# Altium schematic sheet MCU,SD,FLASH.SchDoc
size A3; SheetNumber: 2; SheetTotal: 5
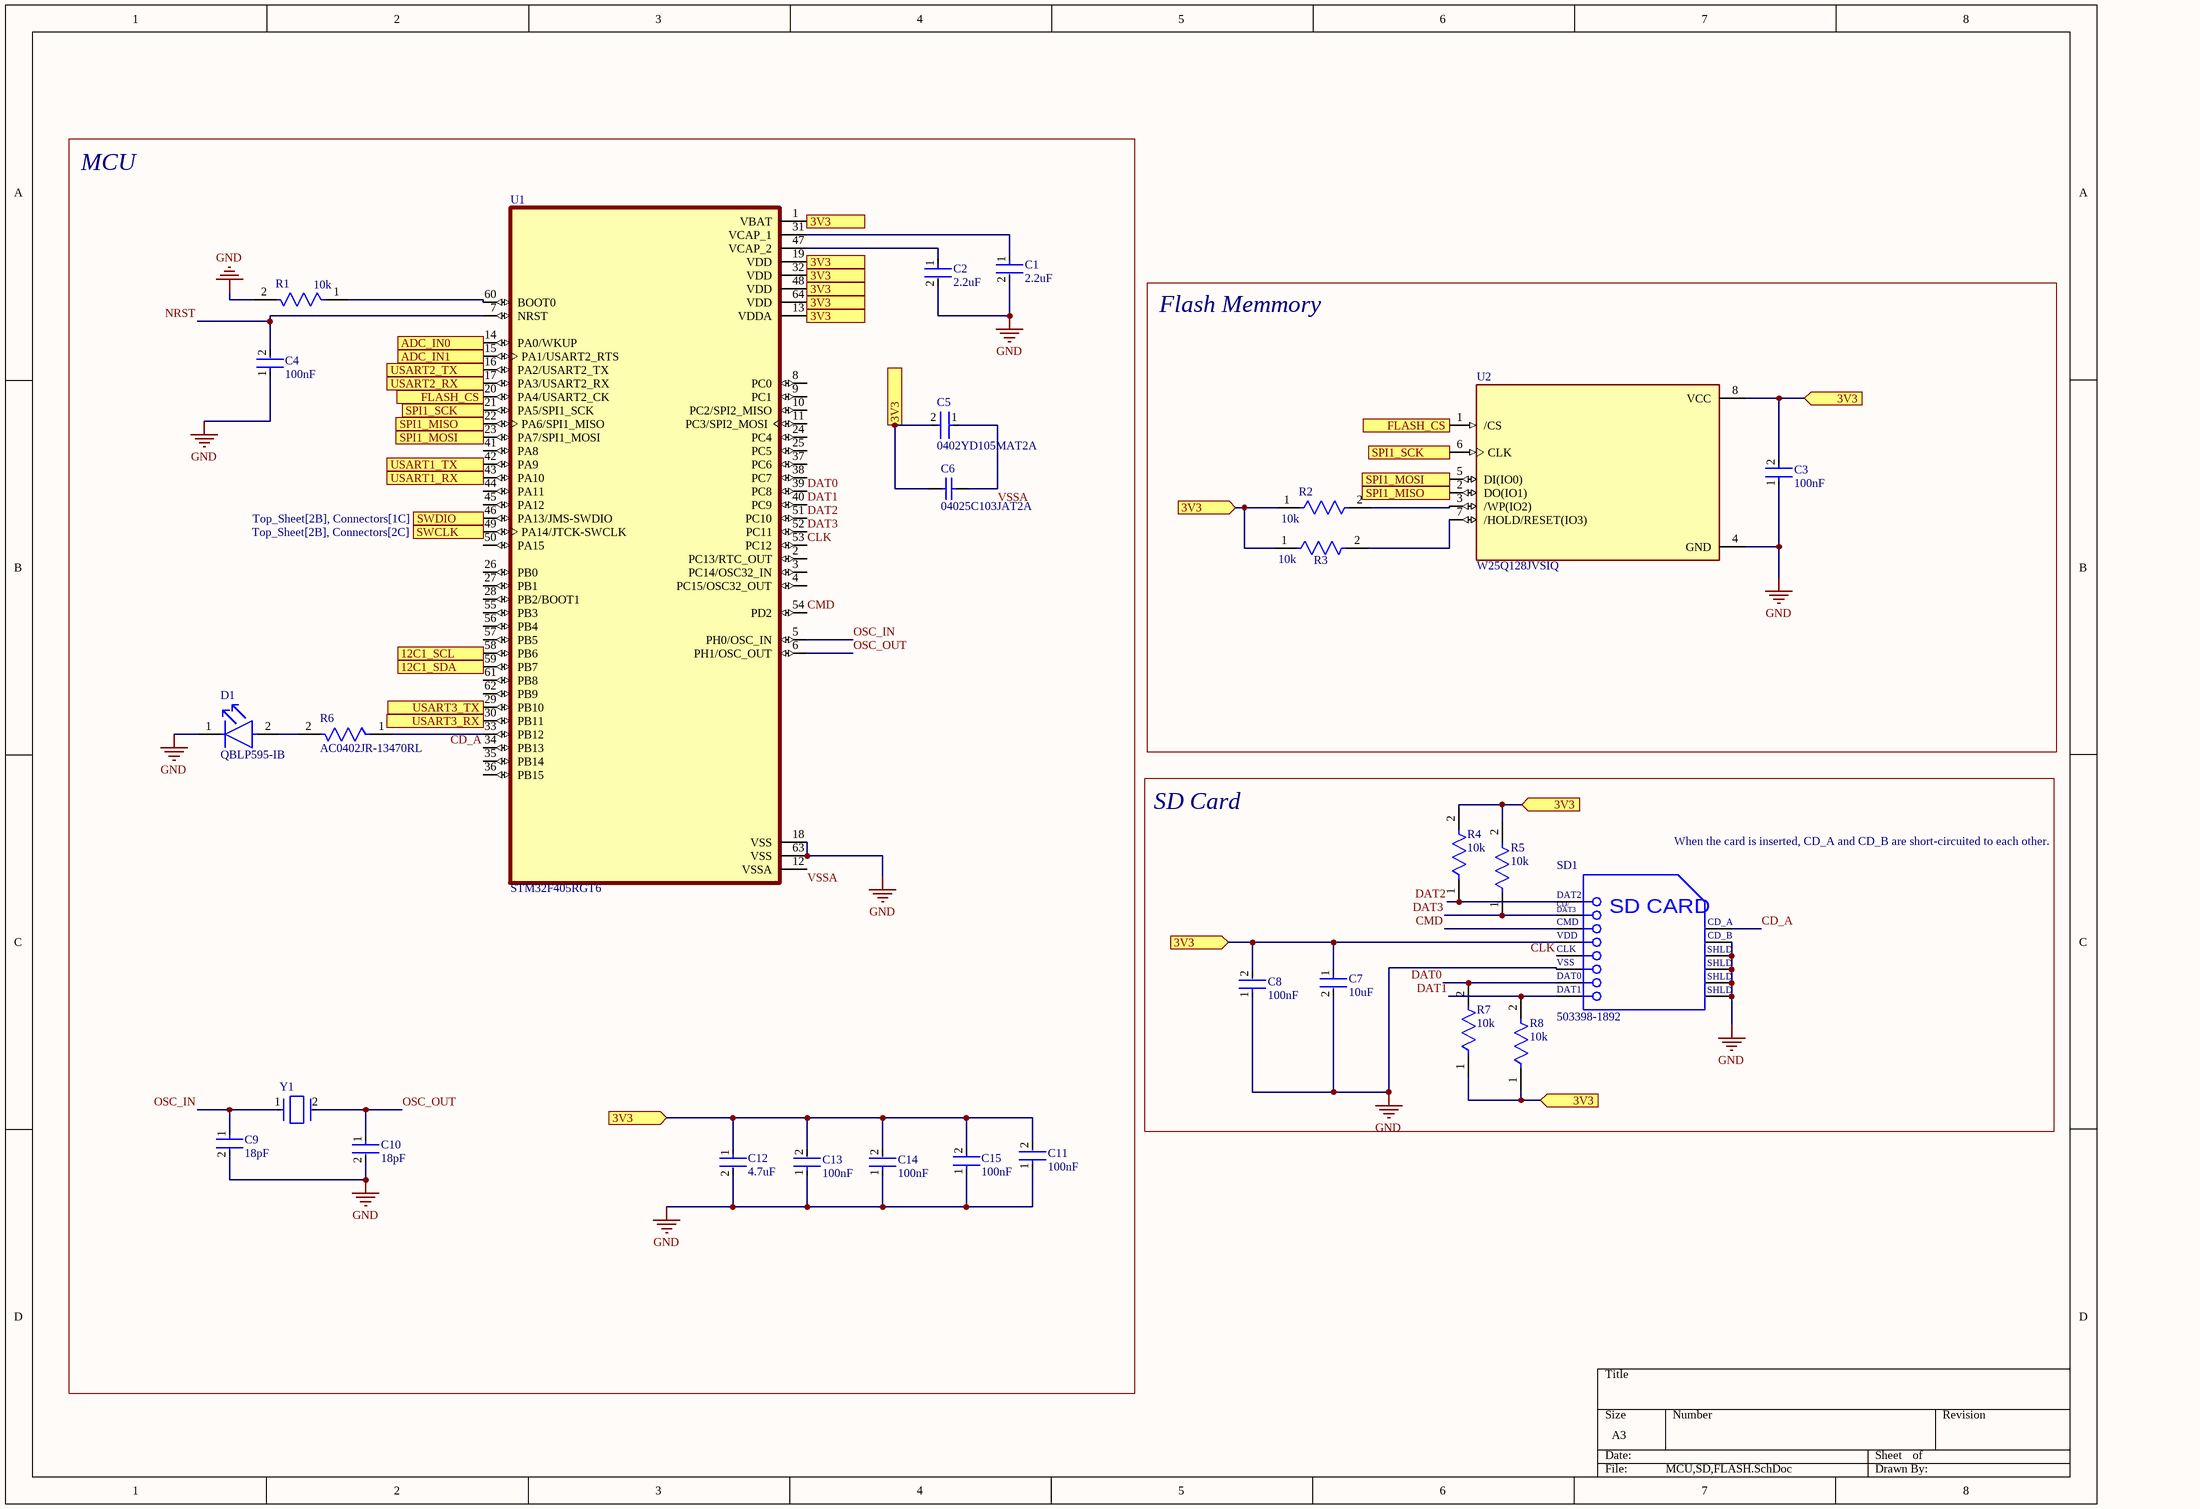
[diagram p0: MCU,SD,FLASH.SchDoc]

## Parts
C1  2.2uF  [FP-CC0402-MFG]
C2  2.2uF  [FP-CC0402-MFG]
C3  100nF  [FP-C0402-BB-MFG]
C4  100nF  [FP-C0402-BB-MFG]
C5  0402YD105MAT2A  [FP-0402-L_1_0_1-W_0_5_0_1-MFG]
C6  04025C103JAT2A  [CAPC1005X56X25LL10T15]
C7  10uF  [FP-C0402C106M9PACTU-MFG]
C8  100nF  [FP-C0402-BB-MFG]
C9  18pF  [FP-GJM033-0_03P-MFG]
C10  18pF  [FP-GJM033-0_03P-MFG]
C11  100nF  [FP-C0402-BB-MFG]
C12  4.7uF  [FP-CC0402-MFG]
C13  100nF  [FP-C0402-BB-MFG]
C14  100nF  [FP-C0402-BB-MFG]
C15  100nF  [FP-C0402-BB-MFG]
D1  QBLP595-IB  [FP-QBLP595-IB-MFG]
R1  10k  [FP-AF0402-IPC_B]
R2  10k  [FP-AF0402-IPC_B]
R3  10k  [FP-AF0402-IPC_B]
R4  10k  [FP-AF0402-IPC_B]
R5  10k  [FP-AF0402-IPC_B]
R6  AC0402JR-13470RL  [FP-AC0402-MFG]
R7  10k  [FP-AF0402-IPC_B]
R8  10k  [FP-AF0402-IPC_B]
SD1  503398-1892  [MOLX-503398-1892_V]
U1  STM32F405RGT6  [QFP50P1200X1200X160-64N]
U2  W25Q128JVSIQ  [SOIC127P790X216-8N]
Y1  ABM3-8.000MHZ-B4Y-T  [FP-ABM3-MFG]  (value not drawn)

## Blocks framed on the sheet
MCU: C1 C2 C4-C6 C9-C15 D1 R1 R6 U1 Y1
Flash Memmory: C3 R2 R3 U2
SD Card: C7 C8 R4 R5 R7 R8 SD1

## Ports
3V3 (in, see Top_Sheet[1B], Connectors[1C], Connectors[2A], Connectors[3A], Connectors[3C], Power[3C], RF_Sensors[2B], RF_Sensors[3A]), 12C1_SCL (out, see Top_Sheet[2B], Connectors[2B]), 12C1_SDA (out, see Top_Sheet[2A], Connectors[2B]), ADC_IN0 (in, see Top_Sheet[2B], Connectors[3A]), ADC_IN1 (in, see Top_Sheet[2B], Connectors[3A]), FLASH_CS (in), FLASH_CS (out), SPI1_MISO (in), SPI1_MISO (out), SPI1_MOSI (in), SPI1_MOSI (out), SPI1_SCK (in), SPI1_SCK (out), SWCLK (in, see Top_Sheet[2B], Connectors[2C]), SWDIO (in, see Top_Sheet[2B], Connectors[1C]), USART1_RX (in, see Top_Sheet[2A], RF_Sensors[2B]), USART1_TX (out, see Top_Sheet[2A], RF_Sensors[2B]), USART2_RX (in, see Top_Sheet[2B], Connectors[2C], RF_Sensors[3B]), USART2_TX (out, see Top_Sheet[2B], Connectors[1C], RF_Sensors[3B]), USART3_RX (in, see Top_Sheet[2B], Connectors[3C]), USART3_TX (out, see Top_Sheet[2B], Connectors[3C])

## Nets
GND: C1.2 C2.2 C3.1 C4.1 C7.2 C8.1 C9.2 C10.2 C11.1 C12.2 C13.1 C14.1 C15.1 D1.1(C) R1.2 SD1.6(VSS) SD1.10(CD_B) SD1.11(SHLD) SD1.12(SHLD) SD1.13(SHLD) SD1.14(SHLD) U1.18(VSS) U1.63(VSS) U2.4(GND)
3V3: C3.2 C5.2 C6.1 C7.1 C8.2 C11.2 C12.1 C13.2 C14.2 C15.2 R2.1 R3.1 R4.2 R5.2 R7.1 R8.1 SD1.4(VDD) U1.1(VBAT) U1.13(VDDA) U1.19(VDD) U1.32(VDD) U1.48(VDD) U1.64(VDD) U2.8(VCC) ; port 3V3
12C1_SCL: U1.58(PB6) ; port 12C1_SCL
12C1_SDA: U1.59(PB7) ; port 12C1_SDA
ADC_IN0: U1.14(PA0/WKUP) ; port ADC_IN0
ADC_IN1: U1.15(PA1/USART2_RTS) ; port ADC_IN1
CD_A: SD1.9(CD_A) U1.34(PB13)
CLK: SD1.5(CLK) U1.53(PC12)
CMD: SD1.3(CMD) U1.54(PD2)
DAT0: R7.2 SD1.7(DAT0) U1.39(PC8)
DAT1: R8.2 SD1.8(DAT1) U1.40(PC9)
DAT2: R4.1 SD1.1(DAT2) U1.51(PC10)
DAT3: R5.1 SD1.2(CD/DAT3) U1.52(PC11)
FLASH_CS: U1.20(PA4/USART2_CK) U2.1(/CS) ; port FLASH_CS
NRST: C4.2 U1.7(NRST)
OSC_IN: C9.1 U1.5(PH0/OSC_IN) Y1.1
OSC_OUT: C10.1 U1.6(PH1/OSC_OUT) Y1.2
SPI1_MISO: U1.22(PA6/SPI1_MISO) U2.2(DO(IO1)) ; port SPI1_MISO
SPI1_MOSI: U1.23(PA7/SPI1_MOSI) U2.5(DI(IO0)) ; port SPI1_MOSI
SPI1_SCK: U1.21(PA5/SPI1_SCK) U2.6(CLK) ; port SPI1_SCK
SWCLK: U1.49(PA14/JTCK-SWCLK) ; port SWCLK
SWDIO: U1.46(PA13/JMS-SWDIO) ; port SWDIO
USART1_RX: U1.43(PA10) ; port USART1_RX
USART1_TX: U1.42(PA9) ; port USART1_TX
USART2_RX: U1.17(PA3/USART2_RX) ; port USART2_RX
USART2_TX: U1.16(PA2/USART2_TX) ; port USART2_TX
USART3_RX: U1.30(PB11) ; port USART3_RX
USART3_TX: U1.29(PB10) ; port USART3_TX
VSSA: C5.1 C6.2 U1.12(VSSA)
NetC1_1: C1.1 U1.31(VCAP_1)
NetC2_1: C2.1 U1.47(VCAP_2)
NetD1_2: D1.2(A) R6.2
NetR1_1: R1.1 U1.60(BOOT0)
NetR2_2: R2.2 U2.3(/WP(IO2))
NetR3_2: R3.2 U2.7(/HOLD/RESET(IO3))
NetR6_1: R6.1 U1.33(PB12)

Not connected (* = marked no-connect by the designer): U1 2(PC13/RTC_OUT) 3(PC14/OSC32_IN) 4(PC15/OSC32_OUT) 8(PC0) 9(PC1) 10(PC2/SPI2_MISO) 11(PC3/SPI2_MOSI) 24(PC4) 25(PC5) 26(PB0) 27(PB1) 28(PB2/BOOT1) 35(PB14) 36(PB15) 37(PC6) 38(PC7) 41(PA8) 44(PA11) 45(PA12) 50(PA15) 55(PB3) 56(PB4) 57(PB5) 61(PB8) 62(PB9)

## Notes on the sheet
- (near SD1) When the card is inserted, CD_A and CD_B are short-circuited to each other.
- (in symbol CMP-2000-05621-1) CD/; DAT3; SD CARD

## Library data of the parts
C1 C2 = CMP-03422-000141-2: CAP CER 2.2UF 16V X5R 0402; Manufacturer Part Number: CC0402MRX5R7BB225; Manufacturer: YAGEO; Material: Ceramic; Temperature Coefficient: 30ppm/°C; Tolerance: 0.2; Automotive Grade: NA; Category: Cap; ComponentLink2URL: http://www.yageo.com/documents/recent/UPY-GP_NP0_16V-to-50V_16.pdf; Octopart: https://octopart.com/cc0402mrx5r7bb225-yageo-81932627; Device Class L3: Ceramic Capacitors; Temperature Range High: +125°C; Height: 0.55mm; Device Class L1: Passive Components; Digikey Description: CAP CER 2.2UF 16V X5R 0402; Ipc Land Pattern Name: CAPC10050X50; Lead Free: Yes; Temperature: -55°C to +125°C; Package: CC0402; Automotive: No; Capacitance: 2.2 uF; Temperature Characteristic: X5R; Footprint Url: http://www.yageo.com/exep/pages/download/literatures/UPY-C_GEN_24.pdf; Value: 2.2 uF; Device Class L2: Capacitors; Voltage Rating: 16 V; ComponentLink2Description: Datasheet; Temperature Range Low: -55°C; RoHS: TRUE
C3 C4 C8 C11 C13-C15 = CMP-1034-02066-3: CAP CER 0.1UF 10V 20% X7R 0402; Manufacturer Part Number: C0402C104M8RACTU; Manufacturer: Kemet; Tolerance: 0.2; Capacitance: 0.10 μF; Value: 0.10 μF; Material: Ceramic; Temperature Coefficient: 15%; Temperature Range Low: -55°C; Device Class L3: Ceramic Capacitors; RoHS: TRUE; Automotive: No; Device Class L2: Capacitors; Temperature Characteristic: X7R; Octopart: https://octopart.com/c0402c104m8ractu-kemet-9144037; Digikey Description: CAP CER 0.1UF 10V 20% X7R 0402; Mouser Description: Multilayer Ceramic Capacitors MLCC - SMD/SMT 10volts 0.1uF X7R 20%; Ipc Land Pattern Name: CAPC10050X50; Voltage Rating: 10 V; Lead Free: Yes; Device Class L1: Passive Components; ComponentLink2URL: https://content.kemet.com/datasheets/KEM_C1002_X7R_SMD.pdf; Category: Cap; ComponentLink2Description: Datasheet; Temperature Range High: +125°C; Height: 0.55mm; Temperature: -55°C to +125°C; Package: C0402-BB
C5 = CMP-04427-002736-1: General Purpose Ceramic Capacitor, 0402, 1uF, 20%, X5R, 15%, 16V; Tolerance: 20%; Case/Package: 0402; Min Operating Temperature: -55°C; Packaging: Tape and Reel; Dielectric: X5R; Capacitance: 1uF; Max Operating Temperature: 85°C; RoHS Compliant: Yes; Voltage Rating (DC): 16V; Package Quantity: 10000
C6 = CMP-2008-02931-1: Manufacturer: AVX Interconnect / Elco; Part Number: 04025C103JAT2A
C7 = CMP-03020-034678-1: CAP CER 10UF 6.3V X5R 0402; Tolerance: 20%; Dielectric Material: Ceramic; Voltage Rating: 6.3V; Thickness: 0.028inch; REACH SVHC: No SVHC; RoHS Compliant: Yes; Case Code (Metric): 1005; Lead Free: Lead Free; Length: 0.039inch; Max Operating Temperature: 85°C; Capacitance: 10uF; Voltage Rating (DC): 6.3V; Min Operating Temperature: -55°C; Case/Package: 0402; Mount: Surface Mount; Case Code (Imperial): 0402; Dielectric: X5R; Packaging: Cut Tape; Width: 0.02inch
C9 C10 = CMP-00260-148574919-1: GJM0335G2A180JB01D Gjm 0201 X8G 18PF 100V 5%; Case/Package: 0201; Dielectric: X8G; Lifecycle Status: Production; Voltage Rating (DC): 100V; Width: 300µm; Capacitance: 18pF; Thickness: 300µm; Length: 600µm; NexarPartId: 148574919
C12 = CMP-03422-000819-1: CAP CER 4.7UF 16V X5R 0402; Manufacturer Part Number: CC0402MRX5R7BB475; Manufacturer: YAGEO; Tolerance: 0.2; Automotive Grade: NA; Material: Ceramic; Temperature Coefficient: 30ppm/°C; Digikey Description: CAP CER 4.7UF 16V X5R 0402; Capacitance: 4.7 uF; Lead Free: Yes; Octopart: https://octopart.com/cc0402mrx5r7bb475-yageo-81932628; Device Class L3: Ceramic Capacitors; Ipc Land Pattern Name: CAPC10050X50; Package: CC0402; Temperature: -55°C to +125°C; Device Class L2: Capacitors; Value: 4.7 uF; Temperature Characteristic: X5R; ComponentLink2URL: http://www.yageo.com/documents/recent/UPY-GP_NP0_16V-to-50V_16.pdf; Temperature Range Low: -55°C; Automotive: No; ComponentLink2Description: Datasheet; Category: Cap; Mouser Description: Multilayer Ceramic Capacitors MLCC - SMD/SMT 4.7uF 16V 20% Ceramic Capacitor; Temperature Range High: +125°C; Voltage Rating: 16 V; Footprint Url: http://www.yageo.com/exep/pages/download/literatures/UPY-C_GEN_24.pdf; Height: 0.55mm; RoHS: TRUE; Device Class L1: Passive Components
D1 = CMP-113271-000002-1: LED BLUE CLEAR 0402 SMD; Lens Size: 0.5mm; Dominant Wavelength: 465nm; Forward Voltage: 3.1V; Lens Color: Colorless; Luminous Intensity: 85mcd; Test Current: 20mA; Viewing Angle: 140°; Lens Style: Flat; Width: 0.5mm; Case Code (Metric): 1005; Lens Transparency: Clear; Color: Blue; Packaging: Tape and Reel; Case Code (Imperial): 0402; Mount: Surface Mount; Length: 1mm; Case/Package: 0402; Height: 0.6mm
R1-R5 R7 R8 = CMP-03412-046242-1: Anti-Sulfurated Chip Resistors Automotive Grade 10kΩ 1% 100ppm/°C 0402; Power Rating: 62.5mW; Temperature Coefficient: 200ppm/°C; Resistance: 10kR; Voltage Rating: 50V; Max Power Dissipation: 63mW; Case/Package: 0402; Length: 1mm; Number of Terminations: 2; Package Quantity: 10000; Width: 0.5mm; Features: Anti-Sulfur; Series: AF; Tolerance: 1%; Case Code (Imperial): 0402; Case Code (Metric): 1005; Resistor Type: Thick Film; Height: 0.32mm; RoHS Compliant: Yes; Max Operating Temperature: 155°C; Min Operating Temperature: -55°C; Termination: SMD/SMT; Technology: THICK FILM; Weight: 2.3E-05oz; Packaging: Cut Tape
R6 = CMP-03412-049712-1: RES 470Ω ±5% 0.063W 0402
SD1 = CMP-2000-05621-1: Micro SD Connector, Pitch 1.1 mm, 8 Position, Height 1.4 mm, -25 to 85 degC, RoHS, Tape and Reel; Manufacturer: Molex; Voltage Rating: 10VAC/DC; Current Rating: 500mA; Manufacturer URL: http://www.molex.com/; Package Reference: 503398-1892; Packaging: Reel; RoHS: Details; Brand: Molex; Datasheet URL: http://www.molex.com/pdm_docs/sd/5033981892_sd.pdf; Mounting Technology: SurfaceMount; Factory Pack Quantity: 2400; Datasheet Version: Rev. E, 04/2006; Series: 503398; Product Category: MemoryCardConnectors; Package Description: Micro SD Connector, Pitch 1.1 mm, 8 Position, Height 1.4 mm
U1 = STM32F405RGT6: ARMÂ® CortexÂ®-M4 STM32F4 Microcontroller IC 32-Bit Single-Core 168MHz 1MB (1M x 8) FLASH 64-LQFP (10x10); MF: STMicroelectronics; SnapEDA_Link: https://www.snapeda.com/parts/STM32F405RGT6/STMicroelectronics/view-part/?ref=snap; Package: LQFP-64 STMicroelectronics; Value: *; MP: STM32F405RGT6; Check_prices: https://www.snapeda.com/parts/STM32F405RGT6/STMicroelectronics/view-part/?ref=eda
U2 = W25Q128JVSIQ: FLASH - NOR Memory IC 128Mb (16M x 8) SPI - Quad I/O, QPI, DTR 133 MHz 8-SOIC; MF: Winbond Electronics; SnapEDA_Link: https://www.snapeda.com/parts/W25Q128JVSIQ/Winbond/view-part/?ref=snap; Package: SOIC-8 Winbond Electronics; Value: *; MP: W25Q128JVSIQ; Check_prices: https://www.snapeda.com/parts/W25Q128JVSIQ/Winbond/view-part/?ref=eda
Y1 = CMP-27762-013675-1: Crystal 8MHz ±30ppm 18pF SMD-2 5mm x 3.2mm; ESR (Equivalent Series Resistance): 140R; Max Operating Temperature: 70°C; Frequency Stability: 30ppm; Frequency: 8MHz; RoHS Compliant: Yes; Width: 0.126inch; Min Operating Temperature: -20°C; Frequency Tolerance: 30ppm; Packaging: Tape and Reel; Height: 0.051inch; Mount: Surface Mount; Load Capacitance: 18pF; Length: 0.197inch; Case/Package: SMD/SMT